# Altium schematic sheet DAP_C8T6.SchDoc
size 292 x 193 mm; Author: Power Lin; SheetNumber: 1; SheetTotal: 1; Website: wiki-power.com
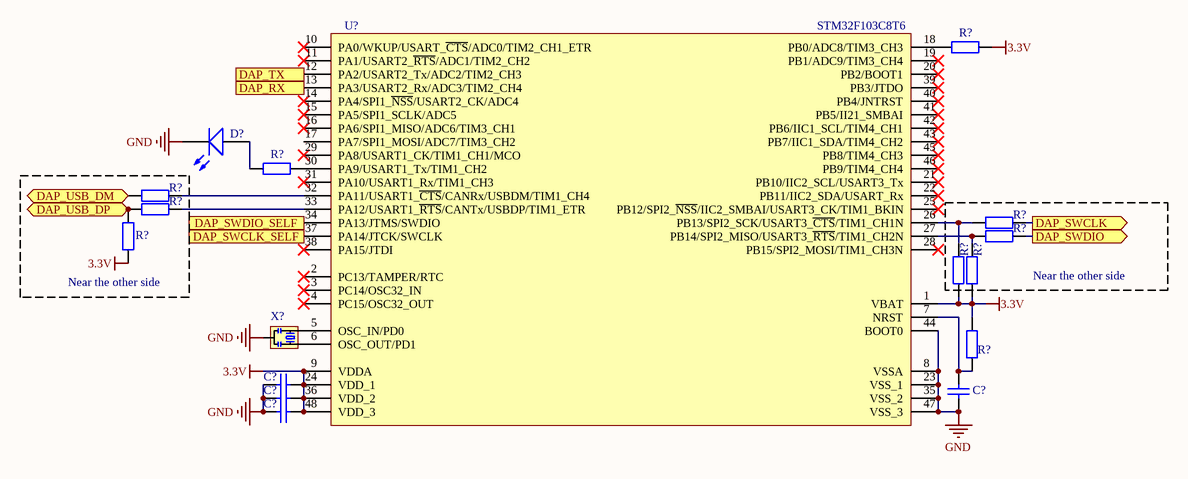
[diagram p0: DAP_C8T6.SchDoc]

## Parts
(Parts that share a designator on the sheet are numbered #1, #2 ... from top to bottom, then left to right.)
C?#1  100nF  [CAP-0603]  (value not drawn)
C?#2  100nF  [CAP-0603]  (value not drawn)
C?#3  100nF  [CAP-0603]  (value not drawn)
C?#4  100nF  [CAP-0603]  (value not drawn)
D?  RED  [LED-0603]  (value not drawn)
R?#1  10K  [R-0603]  (value not drawn)
R?#2  1K  [R-0603]  (value not drawn)
R?#3  39R  [R-0603]  (value not drawn)
R?#4  39R  [R-0603]  (value not drawn)
R?#5  39R  [R-0603]  (value not drawn)
R?#6  1K  [R-0603]  (value not drawn)
R?#7  39R  [R-0603]  (value not drawn)
R?#8  500R  [R-0603]  (value not drawn)
R?#9  500R  [R-0603]  (value not drawn)
R?#10  10K  [R-0603]  (value not drawn)
U?  STM32F103C8T6  [LQFP_48]
X?  8MHz  [CSTCE_G(A)村田晶振]  (value not drawn)

## Blocks framed on the sheet
Near the other side: R?#3 R?#4 R?#6
Near the other side: R?#5 R?#7-R?#9

## Ports
DAP_RX (in), DAP_SWCLK (out), DAP_SWCLK_SELF (in), DAP_SWDIO (out), DAP_SWDIO_SELF (in), DAP_TX (out), DAP_USB_DM (bidir), DAP_USB_DP (bidir)

## Nets
3.3V: C?#1.1 C?#2.1 C?#3.1 R?#1.2 R?#6.1 R?#8.1 R?#9.1 R?#10.2 U?.1(VBAT) U?.9(VDDA) U?.24(VDD_1) U?.36(VDD_2) U?.48(VDD_3)
GND: C?#1.2 C?#2.2 C?#3.2 C?#4.1 D?.K U?.8(VSSA) U?.23(VSS_1) U?.35(VSS_2) U?.44(BOOT0) U?.47(VSS_3) X?.2(GND)
DAP_RX: U?.13(PA3/USART2_Rx/ADC3/TIM2_CH4) ; port DAP_RX
DAP_SWCLK: R?#5.2 ; port DAP_SWCLK
DAP_SWCLK_SELF: U?.37(PA14/JTCK/SWCLK) ; port DAP_SWCLK_SELF
DAP_SWDIO: R?#7.2 ; port DAP_SWDIO
DAP_SWDIO_SELF: U?.34(PA13/JTMS/SWDIO) ; port DAP_SWDIO_SELF
DAP_TX: U?.12(PA2/USART2_Tx/ADC2/TIM2_CH3) ; port DAP_TX
DAP_USB_DM: R?#3.1 ; port DAP_USB_DM
DAP_USB_DP: R?#4.1 R?#6.2 ; port DAP_USB_DP
NetC?#4_2: C?#4.2 R?#10.1 U?.7(NRST)
NetD?_A: D?.A R?#2.1
NetR?#1_1: R?#1.1 U?.18(PB0/ADC8/TIM3_CH3)
NetR?#2_2: R?#2.2 U?.30(PA9/USART1_Tx/TIM1_CH2)
NetR?#3_2: R?#3.2 U?.32(PA11/USART1_~{CTS}/CANRx/USBDM/TIM1_CH4)
NetR?#4_2: R?#4.2 U?.33(PA12/USART1_~{RTS}/CANTx/USBDP/TIM1_ETR)
NetR?#5_1: R?#5.1 R?#8.2 U?.26(PB13/SPI2_SCK/USART3_~{CTS}/TIM1_CH1N)
NetR?#7_1: R?#7.1 R?#9.2 U?.27(PB14/SPI2_MISO/USART3_~{RTS}/TIM1_CH2N)
NetU?_5: U?.5(OSC_IN/PD0) X?.1(OSC1)
NetU?_6: U?.6(OSC_OUT/PD1) X?.3(OSC2)

Not connected (* = marked no-connect by the designer): U? 2(PC13/TAMPER/RTC)* 3(PC14/OSC32_IN)* 4(PC15/OSC32_OUT)* 10(PA0/WKUP/USART_~{CTS}/ADC0/TIM2_CH1_ETR)* 11(PA1/USART2_~{RTS}/ADC1/TIM2_CH2)* 14(PA4/SPI1_~{NSS}/USART2_CK/ADC4)* 15(PA5/SPI1_SCLK/ADC5)* 16(PA6/SPI1_MISO/ADC6/TIM3_CH1)* 17(PA7/SPI1_MOSI/ADC7/TIM3_CH2) 19(PB1/ADC9/TIM3_CH4)* 20(PB2/BOOT1)* 21(PB10/IIC2_SCL/USART3_Tx)* 22(PB11/IIC2_SDA/USART_Rx)* 25(PB12/SPI2_~{NSS}/IIC2_SMBAI/USART3_CK/TIM1_BKIN)* 28(PB15/SPI2_MOSI/TIM1_CH3N)* 29(PA8/USART1_CK/TIM1_CH1/MCO)* 31(PA10/USART1_Rx/TIM1_CH3)* 38(PA15/JTDI)* 39(PB3/JTDO)* 40(PB4/JNTRST)* 41(PB5/II21_SMBAI)* 42(PB6/IIC1_SCL/TIM4_CH1)* 43(PB7/IIC1_SDA/TIM4_CH2)* 45(PB8/TIM4_CH3)* 46(PB9/TIM4_CH4)*

## Notes on the sheet
- Author
- DocumentName
- ModifiedDate
- ProjectName
- SheetNumber
- SheetTotal
- Website
- Revision

## Library data of the parts
C?#1-C?#4 = CAP: 贴片电容; ComponentLink1Description: 供应商链接; ComponentLink1URL: http://www.szlcsc.com/product/details_53938.html; Package: 0402; Supplier: LC; SuppliersPartNumber: C52923
D? = LED: 发光二极管; ComponentLink1Description: 供应商链接; ComponentLink1URL: http://www.szlcsc.com/product/details_2663.html; Package: 0603; Supplier: LC; SuppliersPartNumber: C2290
R?#1-R?#10 = RES: 贴片电阻; Package: 0805; Supplier: LC; SuppliersPartNumber: C17798
U? = STM32F103Cx: 微控制器
X? = XTAL: 有源晶振